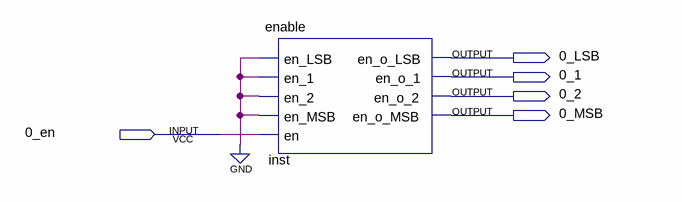
[diagram p0: schematic sheet]
// Quartus schematic 0_en.bdf as structural Verilog: 1 symbols, 5 pins
module \0_en  (
  input  \0_en ,
  output \0_LSB ,
  output \0_1 ,
  output \0_2 ,
  output \0_MSB 
);

  enable inst (
    .en_LSB(1'b0), .en_1(1'b0), .en_2(1'b0), .en_MSB(1'b0), .en(\0_en ), .en_o_LSB(\0_LSB ), .en_o_1(\0_1 ),
    .en_o_2(\0_2 ), .en_o_MSB(\0_MSB ));
endmodule
